# EAGLE design Multiplexed_PMP (EAGLE 7.6.0)
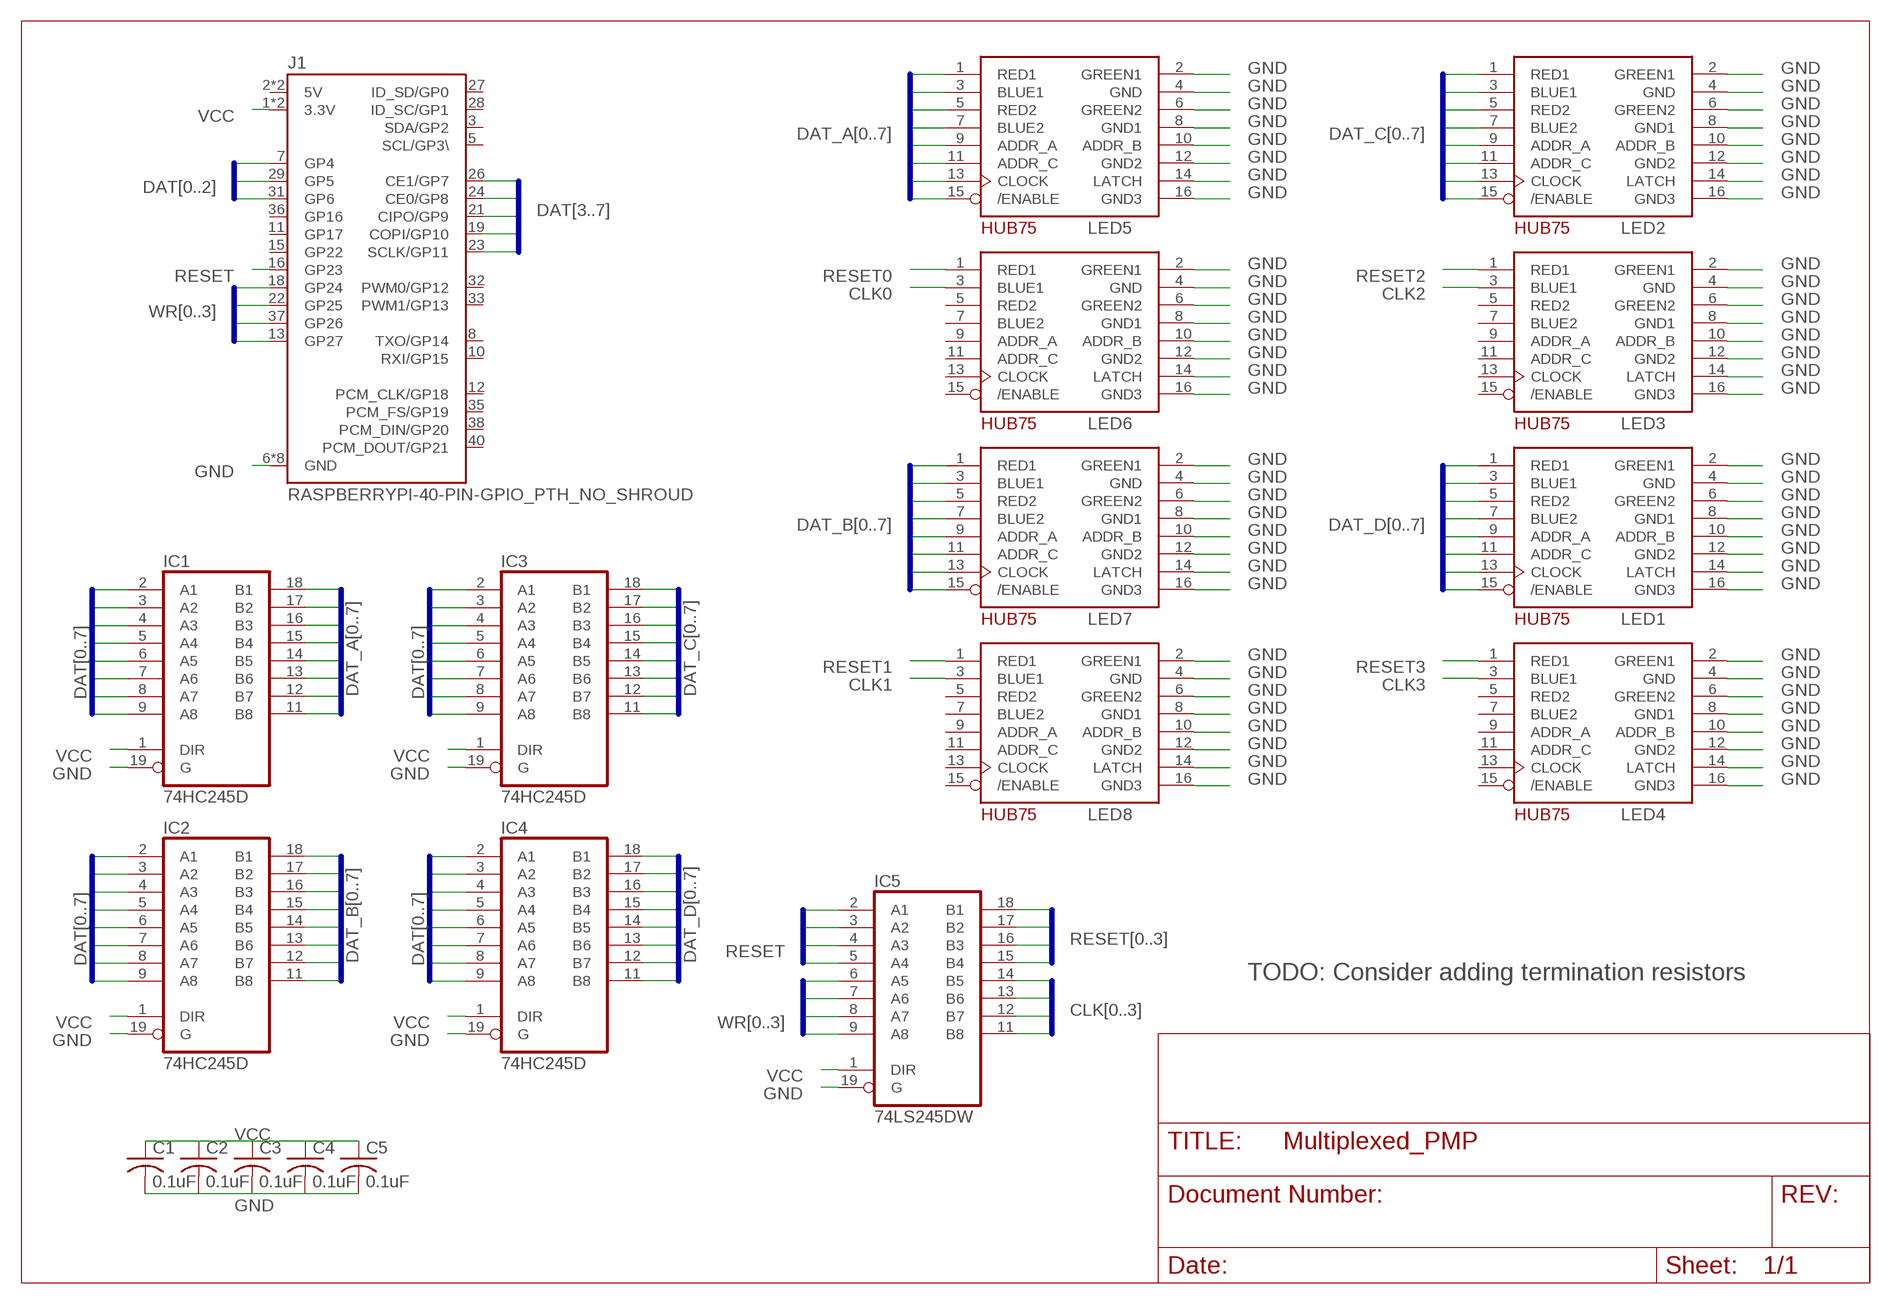
[diagram p0: schematic, sheet 1]

## Parts
C1  0.1uF  C-USC0805  [C0805]
C2  0.1uF  C-USC0805  [C0805]
C3  0.1uF  C-USC0805  [C0805]
C4  0.1uF  C-USC0805  [C0805]
C5  0.1uF  C-USC0805  [C0805]
IC1  74HC245D  74LS245DW  [SO20W]
IC2  74HC245D  74LS245DW  [SO20W]
IC3  74HC245D  74LS245DW  [SO20W]
IC4  74HC245D  74LS245DW  [SO20W]
IC5  74LS245DW  [SO20W]
J1  RASPBERRYPI-40-PIN-GPIO_PTH_NO_SHROUD  [2X20]
LED1  HUB75MATRIX  [2X08-IDC]
LED2  HUB75MATRIX  [2X08-IDC]
LED3  HUB75MATRIX  [2X08-IDC]
LED4  HUB75MATRIX  [2X08-IDC]
LED5  HUB75MATRIX  [2X08-IDC]
LED6  HUB75MATRIX  [2X08-IDC]
LED7  HUB75MATRIX  [2X08-IDC]
LED8  HUB75MATRIX  [2X08-IDC]

## Nets
CLK0: IC5.14(B5) LED6.3(BLUE1)
CLK1: IC5.13(B6) LED8.3(BLUE1)
CLK2: IC5.12(B7) LED3.3(BLUE1)
CLK3: IC5.11(B8) LED4.3(BLUE1)
DAT0: IC1.2(A1) IC2.2(A1) IC3.2(A1) IC4.2(A1) J1.7(GP4)
DAT1: IC1.3(A2) IC2.3(A2) IC3.3(A2) IC4.3(A2) J1.29(GP5)
DAT2: IC1.4(A3) IC2.4(A3) IC3.4(A3) IC4.4(A3) J1.31(GP6)
DAT3: IC1.5(A4) IC2.5(A4) IC3.5(A4) IC4.5(A4) J1.26(CE1/GP7)
DAT4: IC1.6(A5) IC2.6(A5) IC3.6(A5) IC4.6(A5) J1.24(CE0/GP8)
DAT5: IC1.7(A6) IC2.7(A6) IC3.7(A6) IC4.7(A6) J1.21(CIPO/GP9)
DAT6: IC1.8(A7) IC2.8(A7) IC3.8(A7) IC4.8(A7) J1.19(COPI/GP10)
DAT7: IC1.9(A8) IC2.9(A8) IC3.9(A8) IC4.9(A8) J1.23(SCLK/GP11)
DAT_A0: IC1.18(B1) LED5.1(RED1)
DAT_A1: IC1.17(B2) LED5.3(BLUE1)
DAT_A2: IC1.16(B3) LED5.5(RED2)
DAT_A3: IC1.15(B4) LED5.7(BLUE2)
DAT_A4: IC1.14(B5) LED5.9(ADDR_A)
DAT_A5: IC1.13(B6) LED5.11(ADDR_C)
DAT_A6: IC1.12(B7) LED5.13(CLOCK)
DAT_A7: IC1.11(B8) LED5.15(/ENABLE)
DAT_B0: IC2.18(B1) LED7.1(RED1)
DAT_B1: IC2.17(B2) LED7.3(BLUE1)
DAT_B2: IC2.16(B3) LED7.5(RED2)
DAT_B3: IC2.15(B4) LED7.7(BLUE2)
DAT_B4: IC2.14(B5) LED7.9(ADDR_A)
DAT_B5: IC2.13(B6) LED7.11(ADDR_C)
DAT_B6: IC2.12(B7) LED7.13(CLOCK)
DAT_B7: IC2.11(B8) LED7.15(/ENABLE)
DAT_C0: IC3.18(B1) LED2.1(RED1)
DAT_C1: IC3.17(B2) LED2.3(BLUE1)
DAT_C2: IC3.16(B3) LED2.5(RED2)
DAT_C3: IC3.15(B4) LED2.7(BLUE2)
DAT_C4: IC3.14(B5) LED2.9(ADDR_A)
DAT_C5: IC3.13(B6) LED2.11(ADDR_C)
DAT_C6: IC3.12(B7) LED2.13(CLOCK)
DAT_C7: IC3.11(B8) LED2.15(/ENABLE)
DAT_D0: IC4.18(B1) LED1.1(RED1)
DAT_D1: IC4.17(B2) LED1.3(BLUE1)
DAT_D2: IC4.16(B3) LED1.5(RED2)
DAT_D3: IC4.15(B4) LED1.7(BLUE2)
DAT_D4: IC4.14(B5) LED1.9(ADDR_A)
DAT_D5: IC4.13(B6) LED1.11(ADDR_C)
DAT_D6: IC4.12(B7) LED1.13(CLOCK)
DAT_D7: IC4.11(B8) LED1.15(/ENABLE)
GND: C1.2 C2.2 C3.2 C4.2 C5.2 IC1.19(G) IC2.19(G) IC3.19(G) IC4.19(G) IC5.19(G) J1.6(GND) J1.9(GND) J1.14(GND) J1.20(GND) J1.25(GND) J1.30(GND) J1.34(GND) J1.39(GND) LED1.2(GREEN1) LED1.4(GND) LED1.6(GREEN2) LED1.8(GND1) LED1.10(ADDR_B) LED1.12(GND2) LED1.14(LATCH) LED1.16(GND3) LED2.2(GREEN1) LED2.4(GND) LED2.6(GREEN2) LED2.8(GND1) LED2.10(ADDR_B) LED2.12(GND2) LED2.14(LATCH) LED2.16(GND3) LED3.2(GREEN1) LED3.4(GND) LED3.6(GREEN2) LED3.8(GND1) LED3.10(ADDR_B) LED3.12(GND2) LED3.14(LATCH) LED3.16(GND3) LED4.2(GREEN1) LED4.4(GND) LED4.6(GREEN2) LED4.8(GND1) LED4.10(ADDR_B) LED4.12(GND2) LED4.14(LATCH) LED4.16(GND3) LED5.2(GREEN1) LED5.4(GND) LED5.6(GREEN2) LED5.8(GND1) LED5.10(ADDR_B) LED5.12(GND2) LED5.14(LATCH) LED5.16(GND3) LED6.2(GREEN1) LED6.4(GND) LED6.6(GREEN2) LED6.8(GND1) LED6.10(ADDR_B) LED6.12(GND2) LED6.14(LATCH) LED6.16(GND3) LED7.2(GREEN1) LED7.4(GND) LED7.6(GREEN2) LED7.8(GND1) LED7.10(ADDR_B) LED7.12(GND2) LED7.14(LATCH) LED7.16(GND3) LED8.2(GREEN1) LED8.4(GND) LED8.6(GREEN2) LED8.8(GND1) LED8.10(ADDR_B) LED8.12(GND2) LED8.14(LATCH) LED8.16(GND3)
RESET: IC5.2(A1) IC5.3(A2) IC5.4(A3) IC5.5(A4) J1.16(GP23)
RESET0: IC5.18(B1) LED6.1(RED1)
RESET1: IC5.17(B2) LED8.1(RED1)
RESET2: IC5.16(B3) LED3.1(RED1)
RESET3: IC5.15(B4) LED4.1(RED1)
VCC: C1.1 C2.1 C3.1 C4.1 C5.1 IC1.1(DIR) IC2.1(DIR) IC3.1(DIR) IC4.1(DIR) IC5.1(DIR) J1.1(3.3V) J1.17(3.3V)
WR0: IC5.6(A5) J1.18(GP24)
WR1: IC5.7(A6) J1.22(GP25)
WR2: IC5.8(A7) J1.37(GP26)
WR3: IC5.9(A8) J1.13(GP27)
Unconnected: J1.3(SDA/GP2) J1.5(SCL/GP3\) J1.8(TXO/GP14) J1.10(RXI/GP15) J1.11(GP17) J1.12(PCM_CLK/GP18) J1.15(GP22) J1.27(ID_SD/GP0) J1.28(ID_SC/GP1) J1.32(PWM0/GP12) J1.33(PWM1/GP13) J1.35(PCM_FS/GP19) J1.36(GP16) J1.38(PCM_DIN/GP20) J1.40(PCM_DOUT/GP21) LED3.5(RED2) LED3.7(BLUE2) LED3.9(ADDR_A) LED3.11(ADDR_C) LED3.13(CLOCK) LED3.15(/ENABLE) LED4.5(RED2) LED4.7(BLUE2) LED4.9(ADDR_A) LED4.11(ADDR_C) LED4.13(CLOCK) LED4.15(/ENABLE) LED6.5(RED2) LED6.7(BLUE2) LED6.9(ADDR_A) LED6.11(ADDR_C) LED6.13(CLOCK) LED6.15(/ENABLE) LED8.5(RED2) LED8.7(BLUE2) LED8.9(ADDR_A) LED8.11(ADDR_C) LED8.13(CLOCK) LED8.15(/ENABLE)

## Buses
DAT[3..7]
WR[0..3]
DAT_A[0..7]
DAT[0..2]
DAT[0..7]
DAT_B[0..7]
DAT_C[0..7]
DAT_D[0..7]
RESET
CLK[0..3]
RESET[0..3]

## Notes on the sheet
- TODO: Consider adding termination resistors

## Power pins joined to a net without a drawn wire
5V: J1.2(5V) J1.4(5V)
GND: IC1.10(GND) IC2.10(GND) IC3.10(GND) IC4.10(GND) IC5.10(GND)
VCC: IC1.20(VCC) IC2.20(VCC) IC3.20(VCC) IC4.20(VCC) IC5.20(VCC)

## Library data of the parts
C1-C5 = rcl:C-US: CAPACITOR, American symbol
IC1-IC5 = 74xx-us:74*245: Octal BUS TRANSCEIVER, 3-state
J1 = SparkFun-Connectors:RASPBERRYPI-40-PIN-GPIO: Raspberry Pi GPIO Header 2x20 pin connector, as found on B, B+, A+ models. Both shrouded PTH and SMT versions available. SparkFun Products: GPIO Shrouded Header <https://www.sparkfun.com/products/13054>- PTH SparkFun Pi Wedge (Preassembled) <https://www.sparkfun.com/products/13717>
LED1-LED8 = adafruit:HUB75MATRIX

## Board
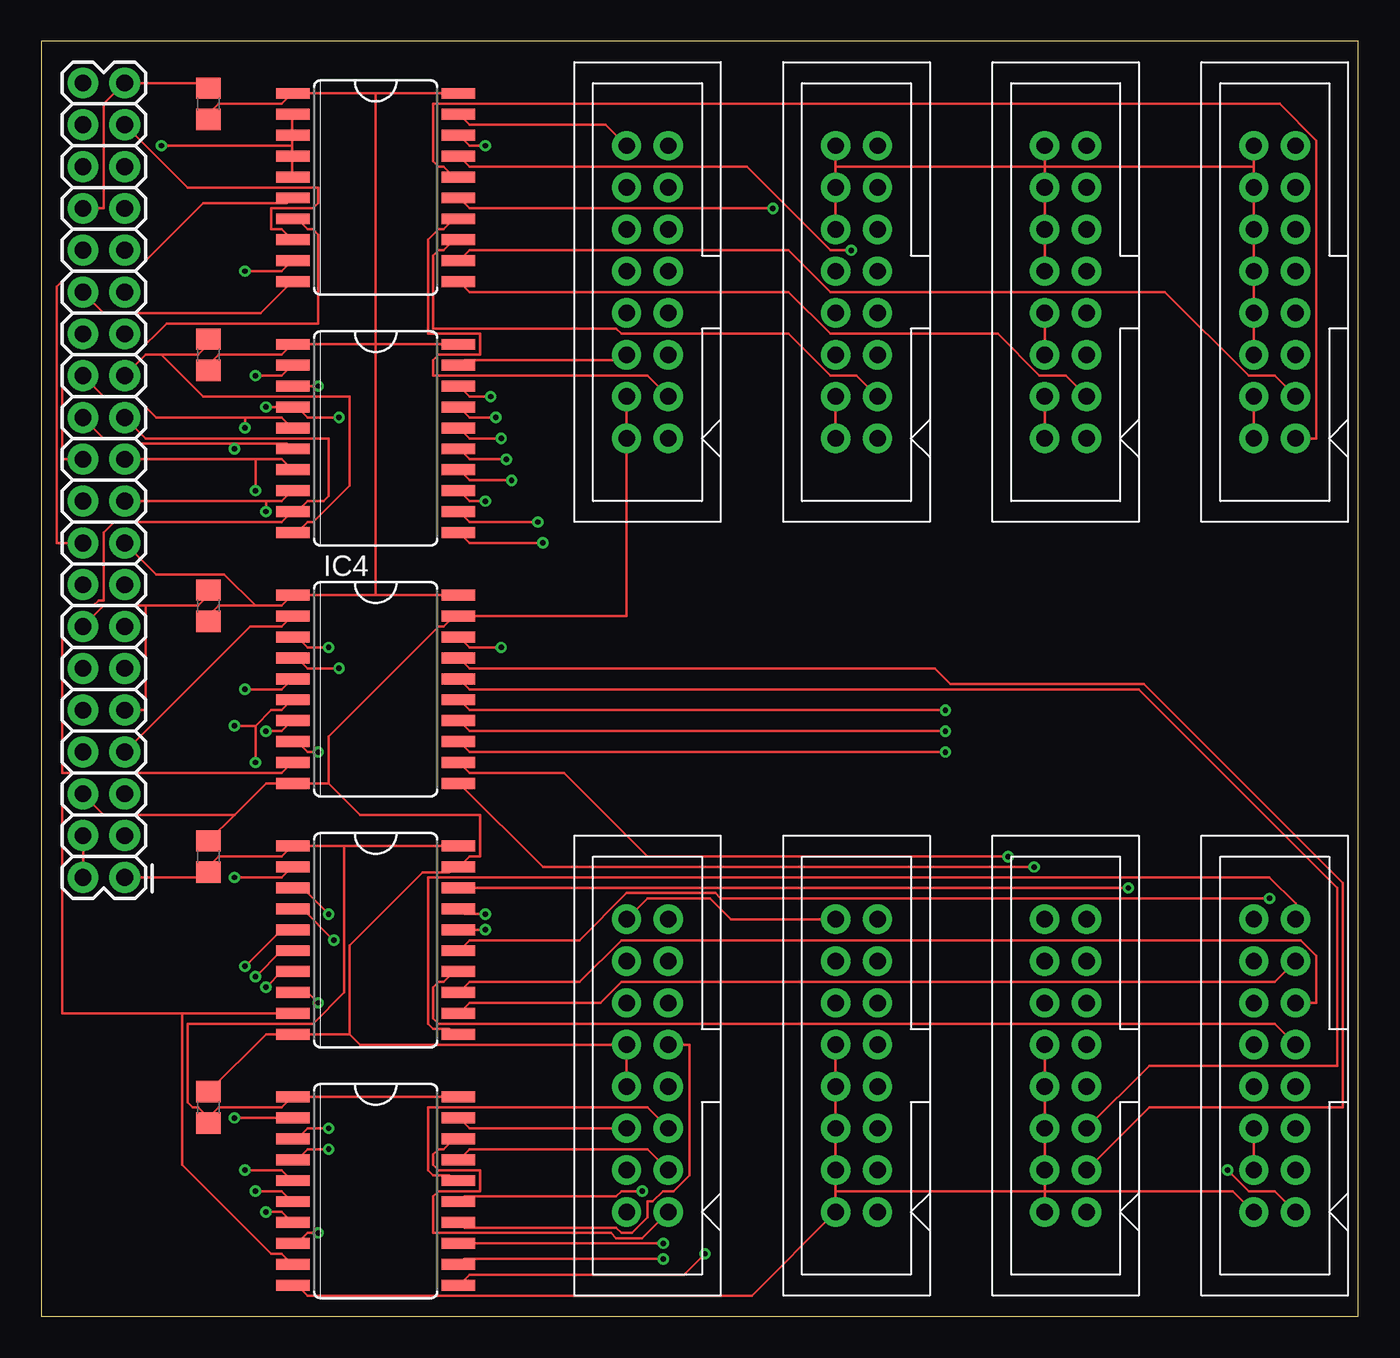
[diagram p1: board, top side]
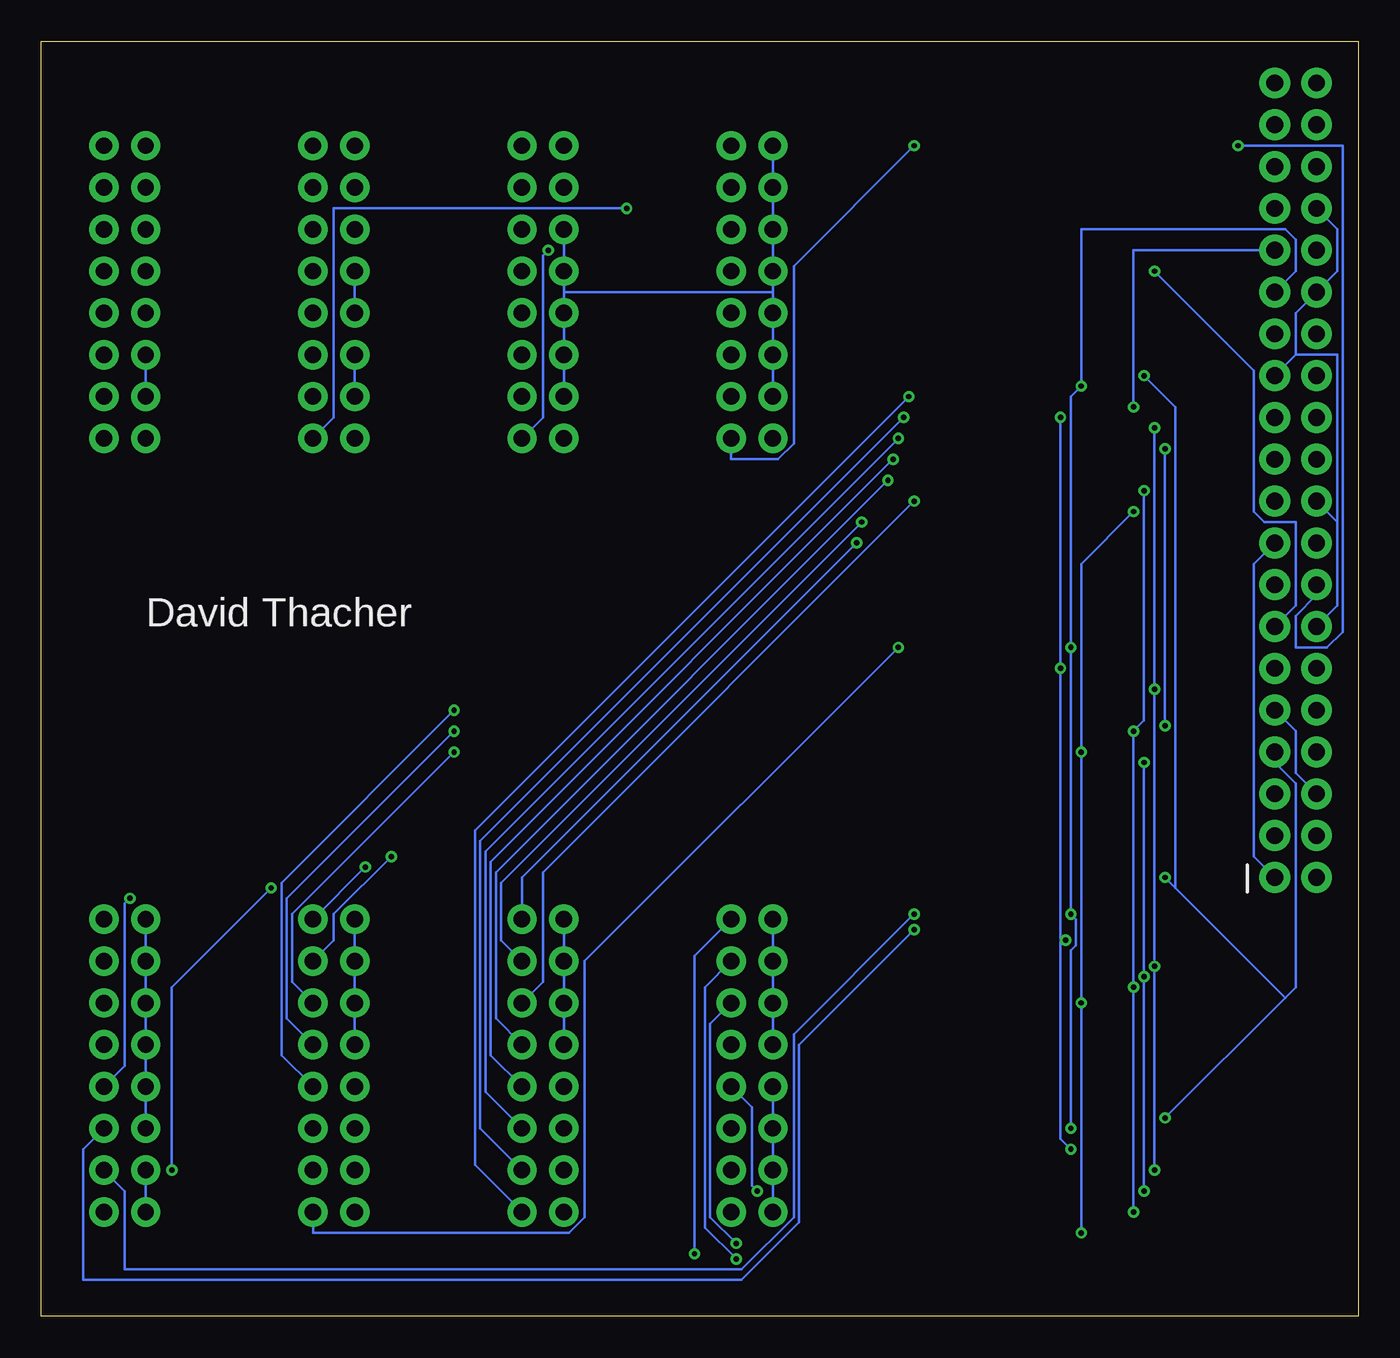
[diagram p2: board, bottom side, seen from below]

Size 80.01 x 77.47 mm. Coordinates in mm from the lower left corner, seen from the top.
Outline: 0,0 80.01,0 80.01,77.47 0,77.47 0,0
Copper layers (1*16): Top 0.0356mm / dielectric 1.5011mm / Bottom 0.0356mm
Design rules "oshpark-2layer": minimum track width 6mil, minimum drill 13mil, track to track 6mil, track to pad 6mil, pad to pad 6mil, via to via 6mil, smd to smd 6mil, copper to edge 15mil, drill to drill 6mil, minimum pad ring 7mil, minimum via ring 7mil, stop-mask expansion 2.5mil, vias tented up to drill 0mil, thermal gap 10mil

### Footprints (pad centres in the part's own frame; a part is rotated, then mirrored left to right if it is on the bottom)
C0805 = smd 1.3 x 1.5: 1 -0.95,0; 2 0.95,0
SO20W = smd 0.66 x 2.032: 1 -5.715,-5.029; 2 -4.445,-5.029; 3 -3.175,-5.029; 4 -1.905,-5.029; 5 -0.635,-5.029; 6 0.635,-5.029; 7 1.905,-5.029; 8 3.175,-5.029; 9 4.445,-5.029; 10 5.715,-5.029; 11 5.715,5.029; 12 4.445,5.029; 13 3.175,5.029; 14 1.905,5.029; 15 0.635,5.029; 16 -0.635,5.029; 17 -1.905,5.029; 18 -3.175,5.029; 19 -4.445,5.029; 20 -5.715,5.029
2X20 = drill 1.016 pad 1.88: 1 0,0; 2 0,2.54; 3 2.54,0; 4 2.54,2.54; 5 5.08,0; 6 5.08,2.54; 7 7.62,0; 8 7.62,2.54; 9 10.16,0; 10 10.16,2.54; 11 12.7,0; 12 12.7,2.54; 13 15.24,0; 14 15.24,2.54; 15 17.78,0; 16 17.78,2.54; 17 20.32,0; 18 20.32,2.54; 19 22.86,0; 20 22.86,2.54; 21 25.4,0; 22 25.4,2.54; 23 27.94,0; 24 27.94,2.54; 25 30.48,0; 26 30.48,2.54; 27 33.02,0; 28 33.02,2.54; 29 35.56,0; 30 35.56,2.54; 31 38.1,0; 32 38.1,2.54; 33 40.64,0; 34 40.64,2.54; 35 43.18,0; 36 43.18,2.54; 37 45.72,0; 38 45.72,2.54; 39 48.26,0; 40 48.26,2.54
2X08-IDC = drill 1 pad 1.778: 1 -1.27,8.89; 2 1.27,8.89; 3 -1.27,6.35; 4 1.27,6.35; 5 -1.27,3.81; 6 1.27,3.81; 7 -1.27,1.27; 8 1.27,1.27; 9 -1.27,-1.27; 10 1.27,-1.27; 11 -1.27,-3.81; 12 1.27,-3.81; 13 -1.27,-6.35; 14 1.27,-6.35; 15 -1.27,-8.89; 16 1.27,-8.89

### Placement (x,y rotation side)
C1  10.16,12.7 90 top
C2  10.16,27.94 90 top
C3  10.16,43.18 90 top
C4  10.16,58.42 90 top
C5  10.16,73.66 90 top
IC1  20.32,7.62 270 top
IC2  20.32,53.34 270 top
IC3  20.32,22.86 270 top
IC4  20.32,38.1 270 top
IC5  20.32,68.58 270 top
J1  5.08,26.67 90 top
LED1  62.23,15.24 180 top
LED2  74.93,15.24 180 top
LED3  74.93,62.23 180 top
LED4  62.23,62.23 180 top
LED5  36.83,15.24 180 top
LED6  36.83,62.23 180 top
LED7  49.53,15.24 180 top
LED8  49.53,62.23 180 top

### Tracks (layer width: path | path; a pad name or v marks a point on that pad's centre or on a via)
5V
  Top 0.152: J1.4 J1.2
CLK0
  Top 0.152: LED6.3 36.83,57.15 23.81,57.15 23.81,58.1 24.13,58.42 26.67,58.42 26.67,59.69 23.5,59.69 23.5,65.41 24.13,66.04 24.45,66.04 25.08,66.67 IC5.14
CLK1
  Top 0.152: LED8.3 49.53,57.15 47.94,57.15 45.4,59.69 35.24,59.69 34.92,60.01 23.81,60.01 23.81,64.45 24.13,64.77 24.45,64.77 25.08,65.41 IC5.13
CLK2
  Top 0.152: LED3.3 74.93,57.15 73.34,57.15 68.26,62.23 47.94,62.23 45.4,64.77 26.04,64.77 25.4,64.14 IC5.12
CLK3
  Top 0.152: LED4.3 62.23,57.15 60.64,57.15 58.1,59.69 47.94,59.69 45.4,62.23 26.04,62.23 25.4,62.87 IC5.11
DAT0  (via drill 0.33)
  Top 0.152: v11.75,12.06 IC1.2 | v11.75,26.67 14.61,26.67 15.24,27.3 IC3.2 | J1.7 12.7,41.91 14.61,41.91 15.24,42.55 IC4.2 | v13.02,57.15 14.61,57.15 15.24,57.78 IC2.2
  Bottom 0.152: 4.45,19.37 3.81,20 3.81,32.38 5.08,33.66 J1.7 | 4.45,19.37 v11.75,12.06 | 4.45,19.37 11.11,26.04 | 11.11,26.04 v11.75,26.67 | v13.02,57.15 11.11,55.24 11.11,26.04
DAT1  (via drill 0.33)
  Top 0.152: v17.46,11.43 16.19,11.43 15.56,10.79 IC1.3 | v17.46,24.45 15.88,26.04 IC3.3 | v17.46,40.64 16.19,40.64 15.56,41.27 IC4.3 | v16.83,56.52 IC2.3
  Bottom 0.152: v17.46,11.43 17.46,22.23 17.14,22.54 17.14,24.13 v17.46,24.45 v17.46,40.64 17.46,55.88 v16.83,56.52 16.83,66.04 4.45,66.04 3.81,65.41 3.81,63.5 J1.29
DAT2  (via drill 0.33)
  Top 0.152: v17.46,10.16 16.19,10.16 15.56,9.53 IC1.4 | v17.78,22.86 15.88,24.77 IC3.4 | v18.1,39.37 16.19,39.37 15.56,40.01 IC4.4 | v18.1,54.61 16.19,54.61 15.56,55.24 IC2.4 v13.65,55.24
  Bottom 0.152: v17.46,10.16 18.1,10.79 18.1,22.54 | v17.78,22.86 18.1,22.54 | 18.1,22.54 v18.1,39.37 v18.1,54.61 | J1.31 13.65,64.77 v13.65,55.24
DAT3  (via drill 0.33)
  Top 0.152: 12.38,54.61 6.99,54.61 5.71,55.88 3.81,55.88 J1.26 | 12.38,54.61 14.61,54.61 15.24,53.98 IC2.5 | v12.38,8.89 14.61,8.89 15.24,8.26 IC1.5 | v12.38,21.27 14.61,23.5 IC3.5 | v12.38,38.1 14.61,38.1 15.24,38.73 IC4.5 | v12.38,53.98 12.38,54.61
  Bottom 0.152: v12.38,8.89 v12.38,21.27 v12.38,38.1 v12.38,53.98
DAT4  (via drill 0.33)
  Top 0.152: 11.75,53.02 6.03,53.02 5.71,53.34 3.81,53.34 J1.24 | 11.75,53.02 14.92,53.02 15.24,52.7 IC2.6 | v13.02,7.62 14.61,7.62 15.24,6.99 IC1.6 | v13.02,20.64 14.61,22.23 IC3.6 | 13.02,35.88 13.97,36.83 14.61,36.83 15.24,37.47 IC4.6 | v13.02,33.66 13.02,35.88 | v11.75,52.7 11.75,53.02 | 13.02,35.88 v11.75,35.88
  Bottom 0.152: v13.02,7.62 v13.02,20.64 v13.02,33.66 | v11.75,35.88 v11.75,52.7
DAT5  (via drill 0.33)
  Top 0.152: J1.21 13.02,52.07 | 13.02,52.07 14.61,52.07 15.24,51.44 IC2.7 | v13.65,6.35 14.61,6.35 15.24,5.71 IC1.7 | v13.65,20 14.61,20.95 IC3.7 | v13.65,35.56 14.61,35.56 15.24,36.2 IC4.7 | v13.02,50.16 13.02,52.07
  Bottom 0.152: v13.65,6.35 v13.65,20 v13.65,35.56 13.02,36.2 v13.02,50.16
DAT6  (via drill 0.33)
  Top 0.152: J1.19 13.65,49.53 | 13.65,49.53 14.61,49.53 15.24,50.16 IC2.8 | v16.83,5.08 16.19,5.08 15.56,4.45 IC1.8 | v16.83,19.05 16.19,19.68 IC3.8 | v16.83,34.29 16.19,34.29 15.56,34.92 IC4.8 | v13.65,48.9 13.65,49.53
  Bottom 0.152: v16.83,5.08 v16.83,19.05 v16.83,34.29 16.83,45.72 v13.65,48.9
DAT7
  Top 0.152: J1.23 6.35,53.34 17.46,53.34 17.46,49.85 17.14,49.53 16.19,49.53 15.56,48.9 IC2.9 15.24,48.9 14.61,48.26 4.45,48.26 3.81,47.62 3.81,43.5 3.49,43.5 3.17,43.18 1.91,43.18 1.27,42.55 1.27,33.02 1.91,33.02 | 8.57,18.41 8.57,9.21 13.97,3.81 14.61,3.81 15.24,3.17 IC1.9 | IC3.9 8.57,18.41 | 1.91,33.02 14.61,33.02 15.24,33.66 IC4.9 | 1.91,33.02 1.27,32.38 1.27,18.41 8.57,18.41
DAT_A0
  Top 0.152: LED5.1 36.51,4.76 34.92,4.76 34.61,5.08 23.81,5.08 23.81,7.3 24.13,7.62 26.67,7.62 26.67,8.89 24.13,8.89 23.81,9.21 23.81,9.84 24.13,10.16 24.45,10.16 25.08,10.79 IC1.18
DAT_A1
  Top 0.152: LED5.3 36.83,10.16 26.04,10.16 25.4,9.53 IC1.17
DAT_A2
  Top 0.152: LED5.5 36.83,12.7 23.5,12.7 23.5,8.89 23.81,8.57 24.77,8.57 25.08,8.26 IC1.16
DAT_A3  (via drill 0.33)
  Top 0.152: v36.51,7.62 35.24,7.62 34.92,7.3 25.72,7.3 25.4,6.99 IC1.15
  Bottom 0.152: v36.51,7.62 36.83,7.94 36.83,12.7 LED5.7
DAT_A4
  Top 0.152: LED5.9 39.37,16.51 39.37,8.57 38.42,7.62 37.78,7.62 37.15,6.99 36.83,6.99 36.83,6.03 35.88,5.08 35.24,5.08 34.92,5.4 25.72,5.4 25.4,5.71 IC1.14
DAT_A5  (via drill 0.33)
  Top 0.152: v37.78,4.45 IC1.13
  Bottom 0.152: v37.78,4.45 39.37,6.03 39.37,17.78 LED5.11
DAT_A6  (via drill 0.33)
  Top 0.152: v37.78,3.49 25.72,3.49 25.4,3.17 IC1.12
  Bottom 0.152: v37.78,3.49 39.69,5.4 39.69,20 LED5.13
DAT_A7  (via drill 0.33)
  Top 0.152: v40.32,3.81 39.05,2.54 26.04,2.54 25.4,1.91 IC1.11
  Bottom 0.152: v40.32,3.81 40.32,21.91 LED5.15
DAT_B0  (via drill 0.33)
  Top 0.152: v27.3,55.88 26.04,55.88 25.4,56.52 IC2.18
  Bottom 0.152: v27.3,55.88 53.66,29.53 53.66,9.21 LED7.1
DAT_B1  (via drill 0.33)
  Top 0.152: v27.62,54.61 26.04,54.61 25.4,55.24 IC2.17
  Bottom 0.152: v27.62,54.61 53.34,28.89 53.34,11.43 LED7.3
DAT_B2  (via drill 0.33)
  Top 0.152: v27.94,53.34 26.04,53.34 25.4,53.98 IC2.16
  Bottom 0.152: v27.94,53.34 53.02,28.26 53.02,13.65 LED7.5
DAT_B3  (via drill 0.33)
  Top 0.152: v28.26,52.07 26.04,52.07 25.4,52.7 IC2.15
  Bottom 0.152: v28.26,52.07 52.7,27.62 52.7,15.88 LED7.7
DAT_B4  (via drill 0.33)
  Top 0.152: v28.57,50.8 26.04,50.8 25.4,51.44 IC2.14
  Bottom 0.152: v28.57,50.8 52.39,26.99 52.39,18.1 LED7.9
DAT_B5  (via drill 0.33)
  Top 0.152: v26.99,49.53 26.04,49.53 25.4,50.16 IC2.13
  Bottom 0.152: v26.99,49.53 49.53,26.99 49.53,20.32 LED7.11
DAT_B6  (via drill 0.33)
  Top 0.152: v30.16,48.26 26.04,48.26 25.4,48.9 IC2.12
  Bottom 0.152: v30.16,48.26 52.07,26.35 52.07,22.86 LED7.13
DAT_B7  (via drill 0.33)
  Top 0.152: v30.48,46.99 26.04,46.99 25.4,47.62 IC2.11
  Bottom 0.152: v30.48,46.99 50.8,26.67 LED7.15
DAT_C0  (via drill 0.33)
  Top 0.152: v66.04,26.04 IC3.18 | v72.07,8.89 73.34,7.62 74.93,7.62 LED2.1
  Bottom 0.152: v66.04,26.04 72.07,20 v72.07,8.89
DAT_C1  (via drill 0.33)
  Top 0.152: v26.99,24.45 25.72,24.45 25.4,24.77 IC3.17
  Bottom 0.152: v26.99,24.45 34.29,17.14 34.29,6.03 37.47,2.86 74.93,2.86 74.93,7.62 LED2.3
DAT_C2  (via drill 0.33)
  Top 0.152: v26.99,23.5 IC3.16
  Bottom 0.152: v26.99,23.5 33.97,16.51 33.97,5.71 37.47,2.22 77.47,2.22 77.47,10.16 LED2.5
DAT_C3  (via drill 0.33)
  Top 0.152: v74.61,25.4 41.27,25.4 40.96,25.72 35.56,25.72 32.7,22.86 26.04,22.86 25.4,22.23 IC3.15
  Bottom 0.152: v74.61,25.4 74.93,25.08 74.93,15.24 LED2.7
DAT_C4
  Top 0.152: LED2.9 74.93,17.78 24.13,17.78 23.81,18.1 23.81,20 24.13,20.32 24.45,20.32 25.08,20.95 IC3.14
DAT_C5
  Top 0.152: LED2.11 77.47,19.05 77.47,21.91 76.52,22.86 35.24,22.86 32.7,20.32 26.04,20.32 25.4,19.68 IC3.13
DAT_C6
  Top 0.152: LED2.13 74.93,20.32 35.24,20.32 33.97,19.05 26.04,19.05 25.4,18.41 IC3.12
DAT_C7
  Top 0.152: LED2.15 76.2,25.08 74.61,26.67 23.5,26.67 23.5,17.78 23.81,17.46 24.77,17.46 25.08,17.14 IC3.11
DAT_D0  (via drill 0.33)
  Top 0.152: v27.94,40.64 26.04,40.64 25.4,41.27 IC4.18
  Bottom 0.152: v27.94,40.64 46.99,21.59 46.99,6.03 47.94,5.08 63.5,5.08 LED1.1
DAT_D1
  Top 0.152: LED1.3 67.31,12.7 79.06,12.7 79.06,26.35 66.99,38.42 55.24,38.42 54.29,39.37 26.04,39.37 25.4,40.01 IC4.17
DAT_D2
  Top 0.152: LED1.5 67.31,15.24 78.74,15.24 78.74,26.04 66.67,38.1 26.04,38.1 25.4,38.73 IC4.16
DAT_D3  (via drill 0.33)
  Top 0.152: v54.93,36.83 26.04,36.83 25.4,37.47 IC4.15
  Bottom 0.152: v54.93,36.83 65.41,26.35 65.41,15.88 LED1.7
DAT_D4  (via drill 0.33)
  Top 0.152: v54.93,35.56 26.04,35.56 25.4,36.2 IC4.14
  Bottom 0.152: v54.93,35.56 65.09,25.4 65.09,18.1 LED1.9
DAT_D5  (via drill 0.33)
  Top 0.152: v54.93,34.29 26.04,34.29 25.4,34.92 IC4.13
  Bottom 0.152: v54.93,34.29 64.77,24.45 64.77,20.32 LED1.11
DAT_D6  (via drill 0.33)
  Top 0.152: v58.74,27.94 36.83,27.94 31.75,33.02 26.04,33.02 25.4,33.66 IC4.12
  Bottom 0.152: v58.74,27.94 62.23,24.45 62.23,22.86 LED1.13
DAT_D7  (via drill 0.33)
  Top 0.152: v60.33,27.3 30.48,27.3 25.4,32.38 IC4.11
  Bottom 0.152: LED1.15 v60.33,27.3
GND
  Top 0.152: C1.2 13.65,17.14 IC3.10 18.73,17.14 | 18.73,17.14 18.73,22.54 23.18,26.99 24.77,26.99 25.08,27.3 IC3.19 25.4,27.3 26.04,27.94 26.67,27.94 26.67,30.48 19.37,30.48 17.46,32.38 | LED5.8 LED5.10 19.37,16.51 18.73,17.14 | LED5.6 26.04,11.43 25.4,12.06 IC1.19 | LED2.4 LED2.6 | 60.96,7.62 LED1.4 LED1.6 LED1.8 LED1.10 | 60.96,7.62 LED1.2 | LED7.10 LED7.8 LED7.6 LED7.4 48.26,7.62 | IC1.10 15.56,1.91 16.19,1.27 43.18,1.27 LED7.2 48.26,7.62 | 48.26,7.62 60.96,7.62 | LED2.2 72.39,7.62 60.96,7.62 | LED5.16 36.83,25.4 40.64,25.4 41.91,24.13 LED7.16 | LED6.16 34.29,72.39 26.04,72.39 25.4,73.03 IC5.19 | LED6.4 LED6.2 35.56,42.55 IC4.19 25.08,42.55 24.45,41.91 24.13,41.91 17.46,35.24 17.46,32.38 | LED6.6 35.24,58.1 25.72,58.1 25.4,57.78 IC2.19 | LED3.16 73.66,69.85 | 73.66,69.85 LED3.14 LED3.12 LED3.10 LED3.8 LED3.6 | LED3.4 LED3.2 | LED8.16 48.26,69.85 | 48.26,69.85 LED8.14 LED8.12 | LED8.4 LED8.2 | LED4.16 60.96,69.85 | 60.96,69.85 LED4.14 LED4.12 LED4.10 | LED4.4 LED4.2 | LED4.8 LED4.6 | 60.96,69.85 48.26,69.85 | 60.96,69.85 73.66,69.85 | 7.3,58.42 6.35,58.42 J1.25 | 7.3,58.42 9.53,58.42 10.16,59.05 C4.2 | 7.3,58.42 9.84,55.88 18.73,55.88 18.73,50.48 16.51,48.26 16.19,48.26 15.56,47.62 IC2.10 | C5.2 9.84,74.93 J1.39 3.81,73.66 3.81,67.31 J1.34 | J1.30 3.81,60.96 13.34,60.96 15.24,62.87 IC5.10 | 6.35,43.18 3.81,43.18 J1.14 | 6.35,43.18 9.53,43.18 10.16,43.81 C3.2 | 11.75,30.48 13.65,32.38 IC4.10 17.46,32.38 | 11.75,30.48 C2.2 | J1.6 3.81,30.48 11.75,30.48 | 6.35,43.18 6.35,36.83 J1.9
  Bottom 0.152: LED5.16 LED5.14 LED5.12 LED5.10 | LED5.2 LED5.4 LED5.6 LED5.8 | LED2.16 LED2.14 LED2.12 LED2.10 LED2.8 LED2.6 | LED2.4 LED2.2 | LED1.16 LED1.14 LED1.12 LED1.10 | LED7.16 LED7.14 LED7.12 LED7.10 | 35.56,62.23 LED6.10 LED6.12 LED6.14 LED6.16 | 35.56,62.23 LED6.8 LED6.6 LED6.4 | LED3.6 LED3.4 | LED8.12 LED8.10 48.26,62.23 | LED8.4 LED8.6 LED8.8 48.26,62.23 | LED4.6 LED4.4 | LED4.8 LED4.10 | 48.26,62.23 35.56,62.23 | J1.34 1.27,66.04 1.27,63.5 J1.30 3.81,60.96 3.81,58.42 | 3.81,58.42 J1.25 | 1.27,48.26 J1.20 | 1.27,48.26 1.27,43.18 J1.14 | J1.9 3.81,35.56 3.81,33.02 J1.6 | 3.81,58.42 1.27,58.42 1.27,48.26
RESET  (via drill 0.33)
  Top 0.152: 15.24,70.48 15.24,69.22 IC5.5 | 15.24,71.75 15.24,73.03 IC5.2 | 15.24,71.75 15.24,71.12 | 15.24,71.12 15.24,70.48 | 15.24,70.48 IC5.4 | 15.24,71.75 IC5.3 | v7.3,71.12 15.24,71.12
  Bottom 0.152: v7.3,71.12 0.95,71.12 0.95,41.59 1.91,40.64 3.81,40.64 3.81,42.55 2.54,43.81 J1.16
RESET0  (via drill 0.33)
  Top 0.152: v26.99,71.12 26.04,71.12 25.4,71.75 IC5.18
  Bottom 0.152: v26.99,71.12 34.29,63.82 34.29,53.02 35.24,52.07 38.1,52.07 LED6.1
RESET1  (via drill 0.33)
  Top 0.152: v49.21,64.77 47.94,64.77 42.86,69.85 26.04,69.85 25.4,70.48 IC5.17
  Bottom 0.152: v49.21,64.77 49.53,64.45 49.53,54.61 LED8.1
RESET2
  Top 0.152: LED3.1 77.47,53.34 77.47,71.44 75.25,73.66 23.81,73.66 23.81,70.17 24.13,69.85 24.45,69.85 25.08,69.22 IC5.16
RESET3  (via drill 0.33)
  Top 0.152: v44.45,67.31 26.04,67.31 25.4,67.94 IC5.15
  Bottom 0.152: v44.45,67.31 62.23,67.31 62.23,54.61 LED4.1
VCC
  Top 0.152: 10.16,12.06 10.79,12.7 14.61,12.7 15.24,13.34 IC1.1 IC1.20 | J1.1 9.84,26.67 C2.1 10.16,27.3 10.79,27.94 14.61,27.94 15.24,28.57 IC3.1 18.41,28.57 | IC3.20 18.41,28.57 | 10.16,12.06 9.53,12.7 9.21,12.7 8.89,13.02 8.89,17.78 16.51,17.78 18.41,19.68 18.41,28.57 | 10.16,12.06 C1.1 | 13.02,43.18 14.61,43.18 15.24,43.81 IC4.1 20.32,43.81 | 13.02,43.18 10.79,43.18 10.16,42.55 C3.1 | 20.32,43.81 IC4.20 | J1.17 6.99,45.09 11.11,45.09 13.02,43.18 | C4.1 10.16,57.78 10.79,58.42 14.61,58.42 15.24,59.05 IC2.1 20.32,59.05 | 20.32,59.05 IC2.20 | C5.1 10.16,73.03 10.79,73.66 14.61,73.66 15.24,74.3 IC5.1 20.32,74.3 | 20.32,74.3 IC5.20 | 20.32,74.3 20.32,59.05 | 20.32,59.05 20.32,43.81
  Bottom 0.152: J1.1 6.35,27.94 6.35,45.72 J1.17
WR0
  Top 0.152: J1.18 0.95,46.99 0.95,62.55 1.91,63.5 5.71,63.5 9.84,67.63 14.92,67.63 15.24,67.94 IC5.6
WR1
  Top 0.152: J1.22 1.27,52.07 1.27,57.78 1.91,58.42 5.71,58.42 7.62,60.33 16.83,60.33 16.83,65.72 16.51,66.04 16.19,66.04 15.56,66.67 IC5.7
WR2
  Top 0.152: J1.37 8.89,68.58 16.83,68.58 16.83,67.63 16.51,67.31 13.97,67.31 13.97,66.04 14.61,66.04 15.24,65.41 IC5.8
WR3  (via drill 0.33)
  Top 0.152: v12.38,63.5 14.61,63.5 15.24,64.14 IC5.9
  Bottom 0.152: v12.38,63.5 6.35,57.47 6.35,48.9 5.71,48.26 3.81,48.26 3.81,43.18 J1.13

### Text on the board
bNames: David Thacher